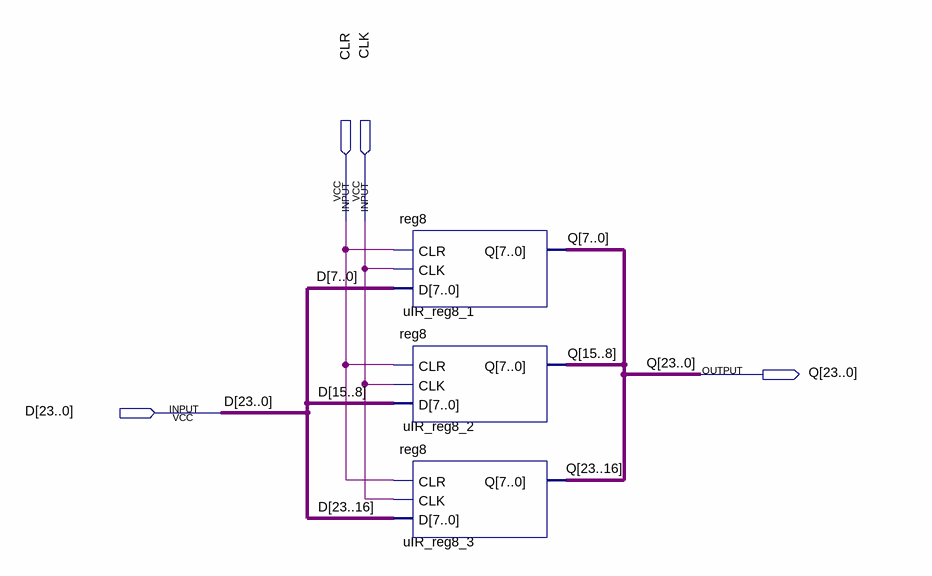
[diagram p0: schematic sheet]
// Quartus schematic uIR.bdf as structural Verilog: 3 symbols, 4 pins
module uIR (
  input  CLR,
  input  CLK,
  input  [23:0] D,
  output [23:0] Q
);

  reg8 uIR_reg8_1 (.CLR(CLR), .CLK(CLK), .D(D[7:0]), .Q(Q[7:0]));
  reg8 uIR_reg8_2 (.CLR(CLR), .CLK(CLK), .D(D[15:8]), .Q(Q[15:8]));
  reg8 uIR_reg8_3 (.CLR(CLR), .CLK(CLK), .D(D[23:16]), .Q(Q[23:16]));
endmodule
